# Altium schematic sheet Main.SchDoc: Actuators
size A1; SheetNumber: 1; SheetTotal: 1
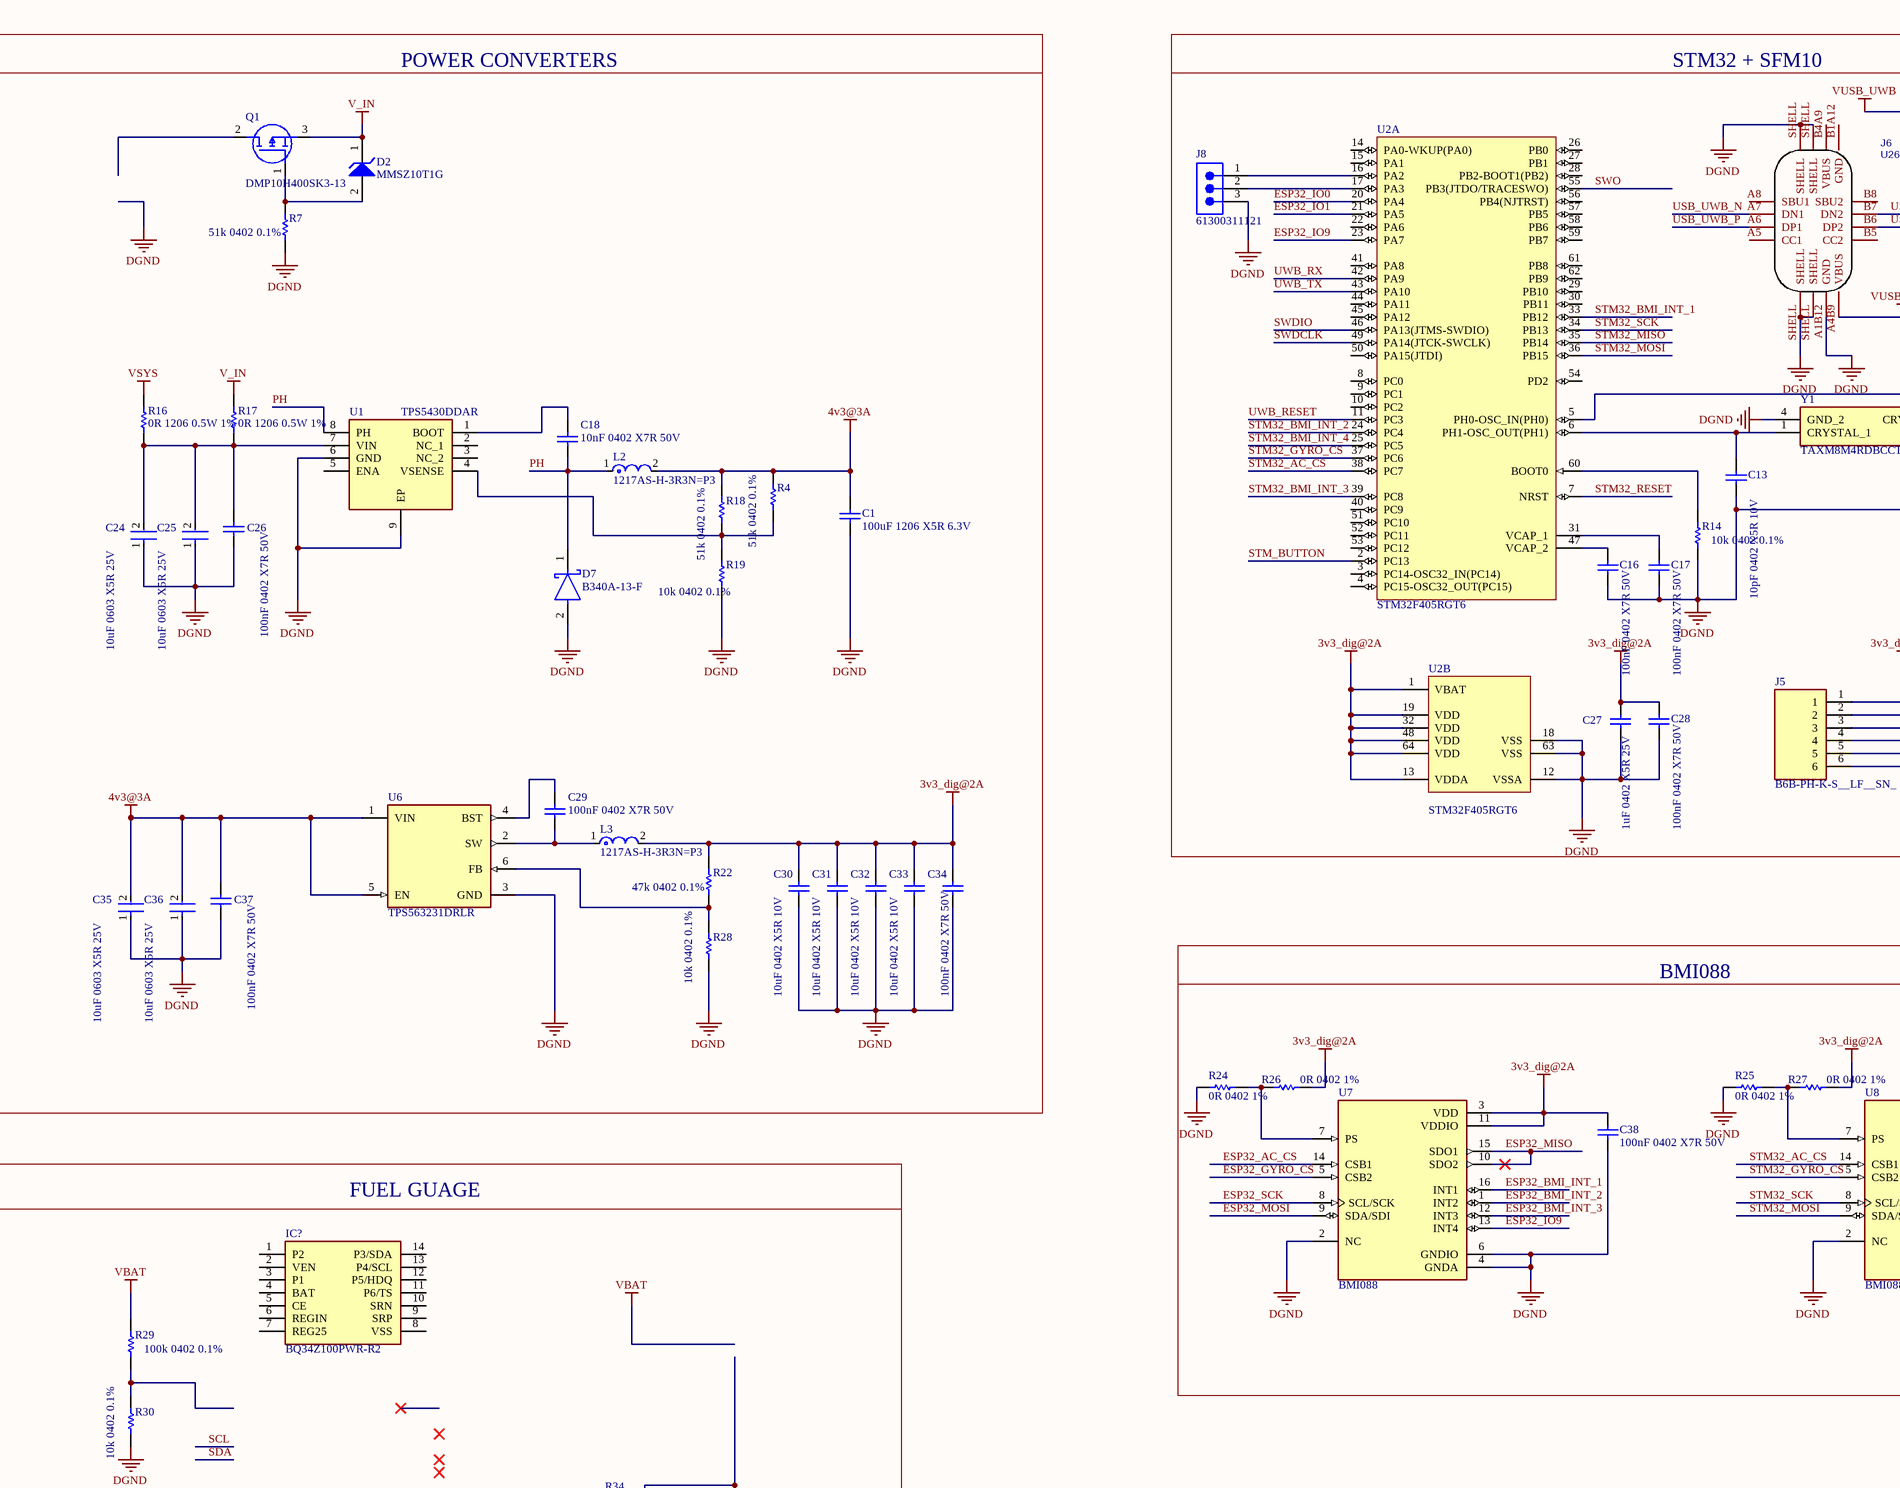
[diagram p0: Main.SchDoc, top left]
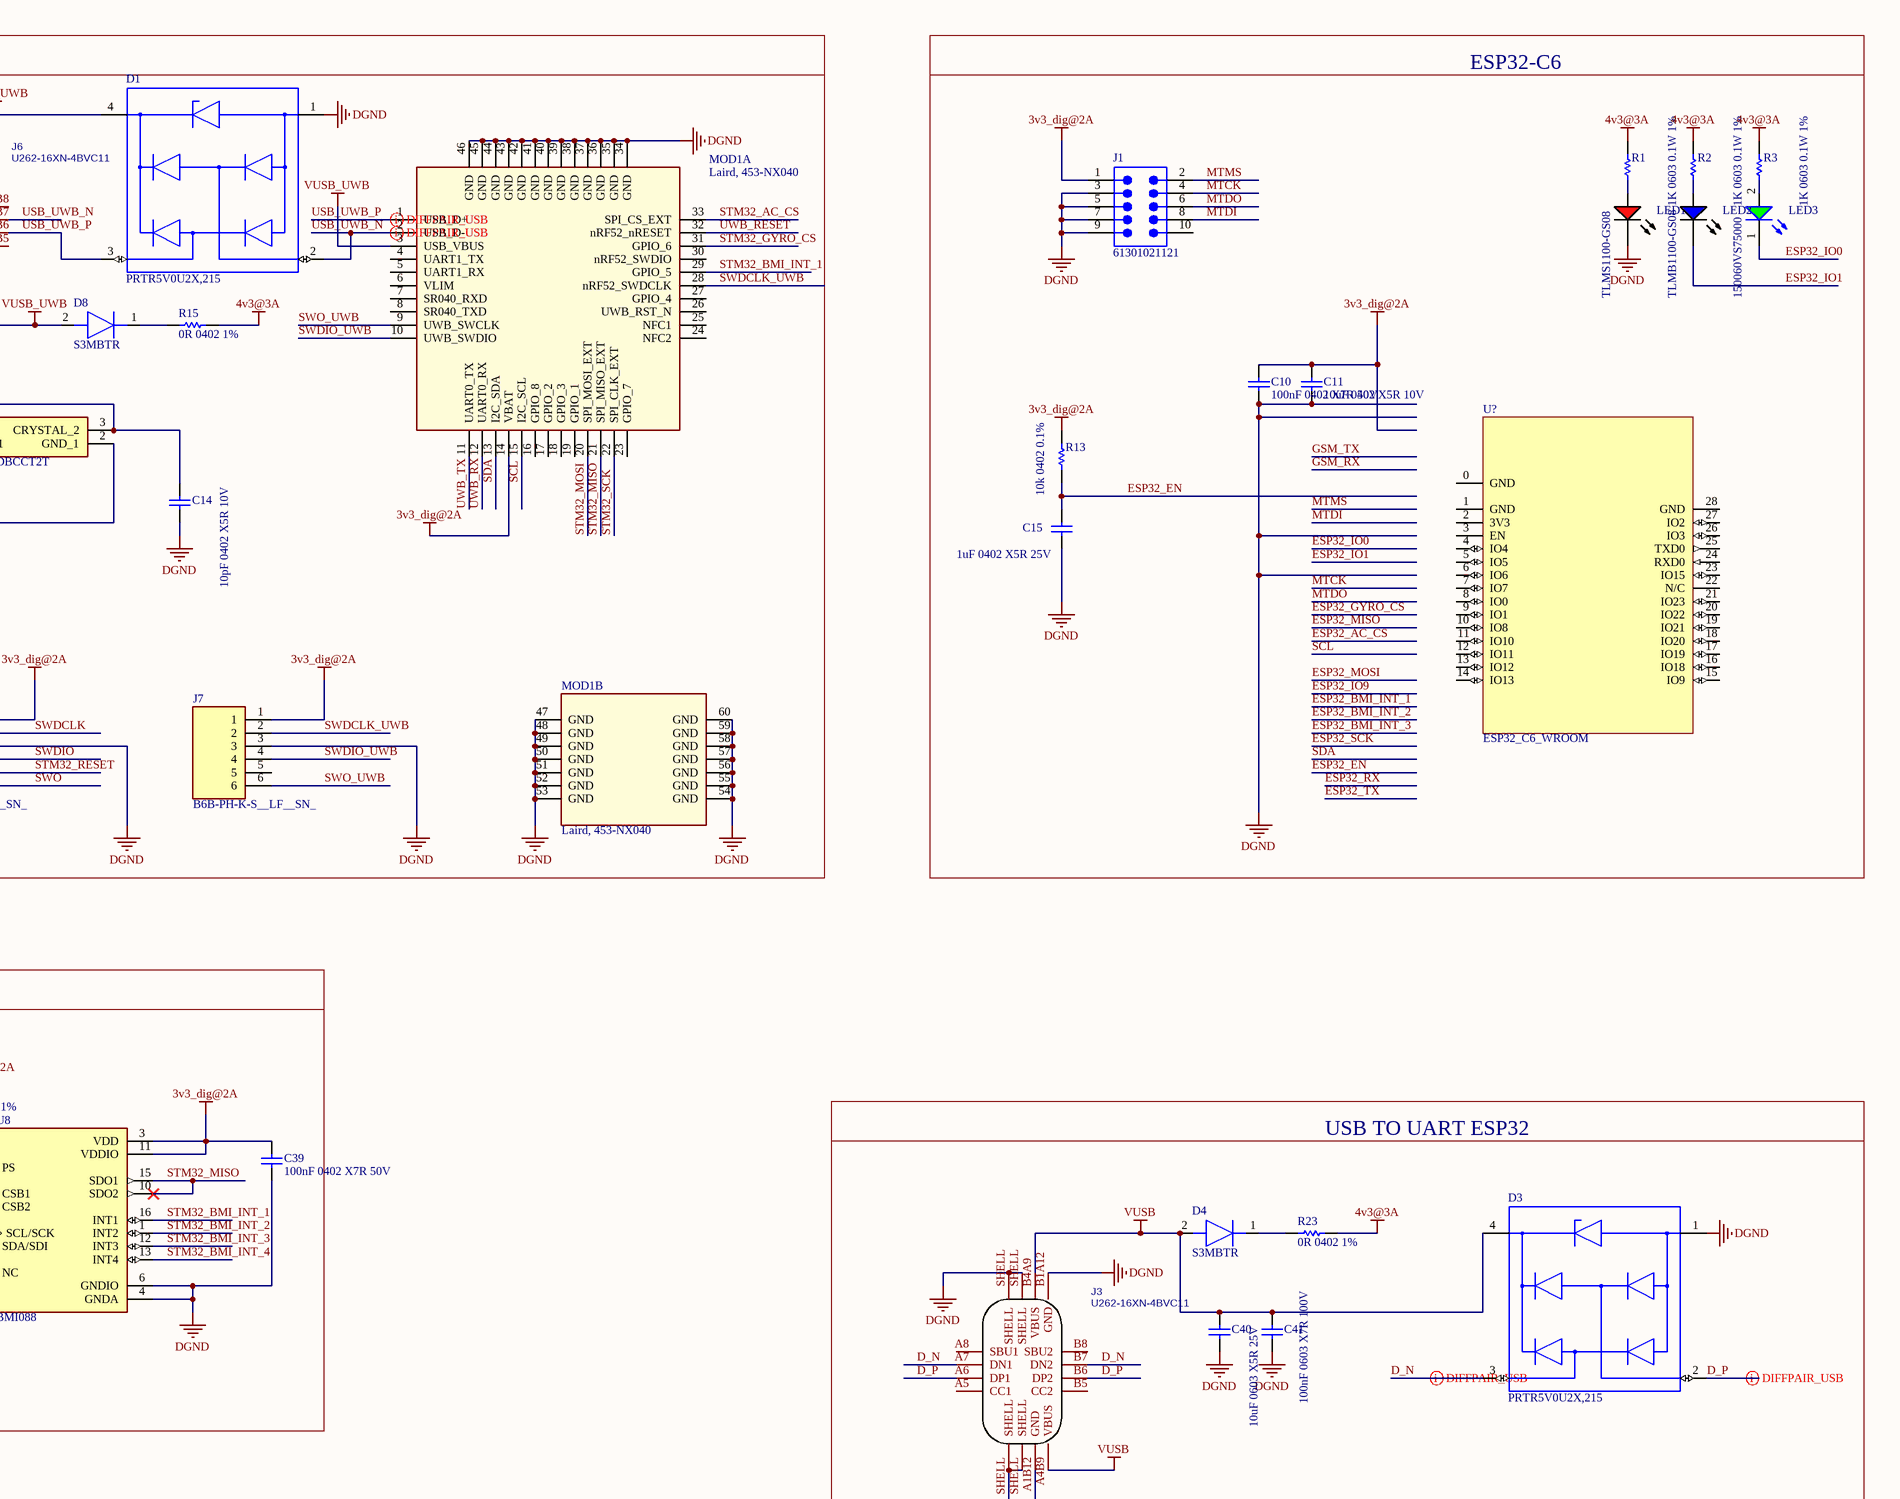
[diagram p1: Main.SchDoc, top right]
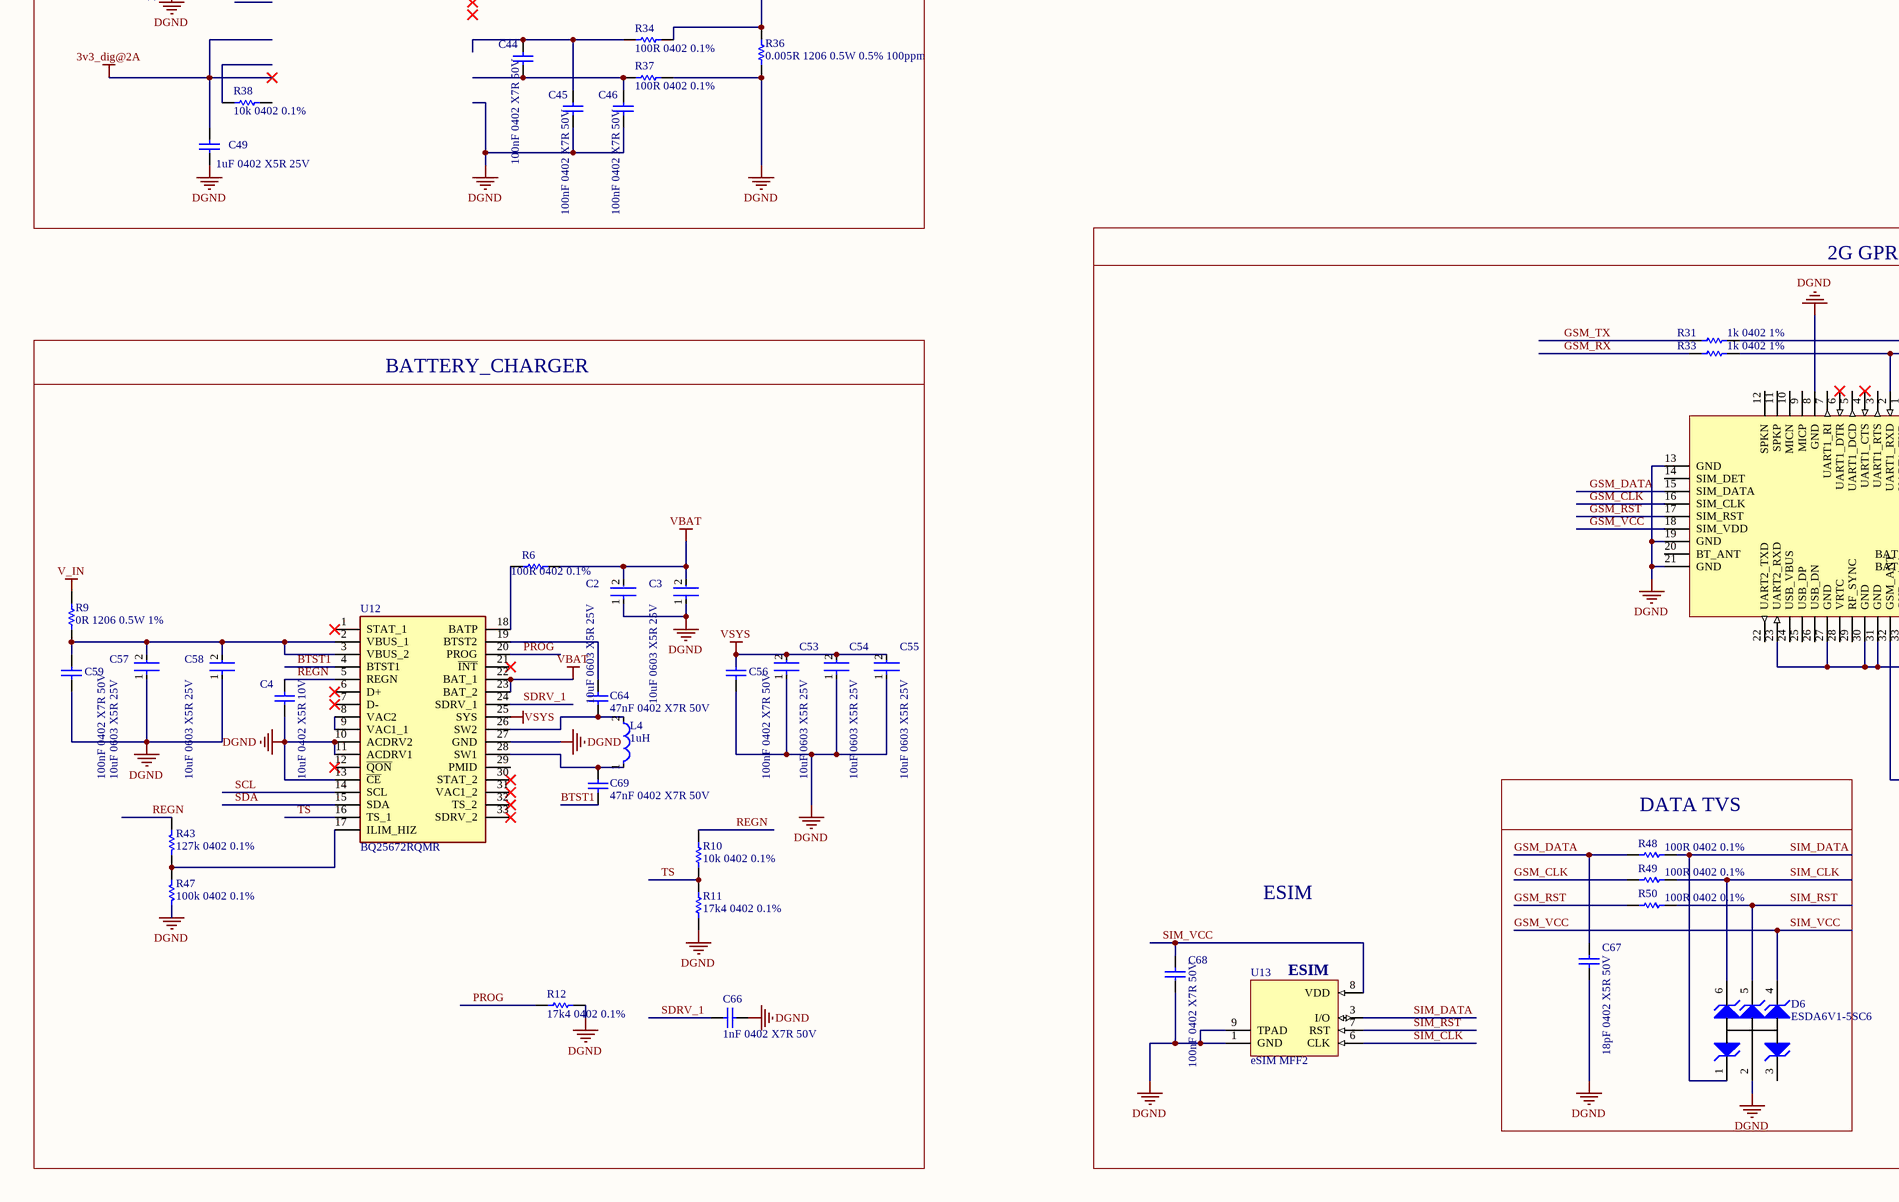
[diagram p2: Main.SchDoc, bottom left]
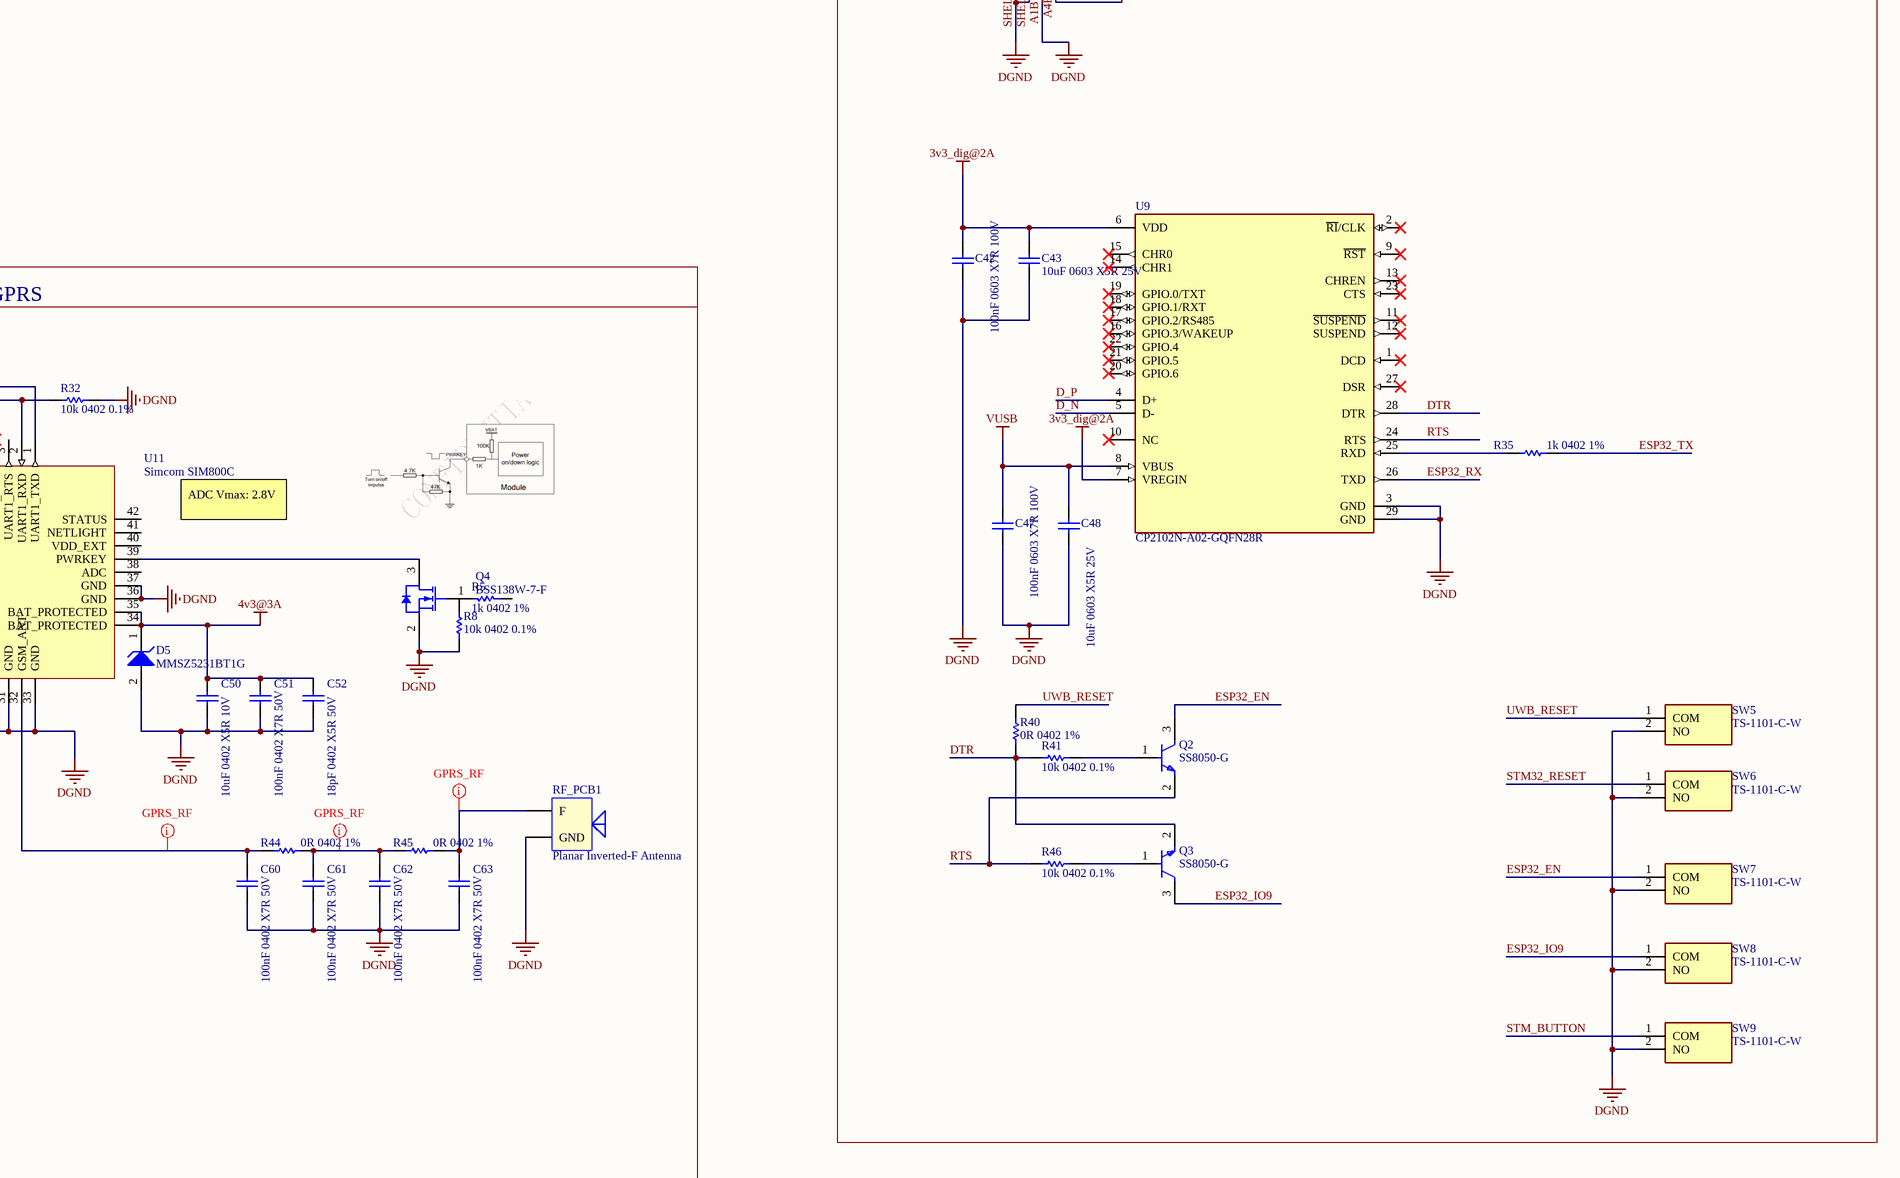
[diagram p3: Main.SchDoc, bottom right]

## Parts
C1  100uF 1206 X5R 6.3V  [CAPC3216X190X55ML30T25]
C2  10uF 0603 X5R 25V  [FP-GRM188-0_2-IPC_B]
C3  10uF 0603 X5R 25V  [FP-GRM188-0_2-IPC_B]
C4  10uF 0402 X5R 10V  [CAPC1005X55X25NL5T10]
C10  100nF 0402 X7R 50V  [CAPC1005X55X25NL5T10]
C11  10uF 0402 X5R 10V  [CAPC1005X55X25NL5T10]
C13  10pF 0402 X5R 10V  [CAPC1005X55X25NL5T10]
C14  10pF 0402 X5R 10V  [CAPC1005X55X25NL5T10]
C15  1uF 0402 X5R 25V  [CAPC1005X55X25NL5T10]
C16  100nF 0402 X7R 50V  [CAPC1005X55X25NL5T10]
C17  100nF 0402 X7R 50V  [CAPC1005X55X25NL5T10]
C18  10nF 0402 X7R 50V  [CAPC1005X55X25NL5T10]
C24  10uF 0603 X5R 25V  [FP-GRM188-0_2-IPC_B]
C25  10uF 0603 X5R 25V  [FP-GRM188-0_2-IPC_B]
C26  100nF 0402 X7R 50V  [CAPC1005X55X25NL5T10]
C27  1uF 0402 X5R 25V  [CAPC1005X55X25NL5T10]
C28  100nF 0402 X7R 50V  [CAPC1005X55X25NL5T10]
C29  100nF 0402 X7R 50V  [CAPC1005X55X25NL5T10]
C30  10uF 0402 X5R 10V  [CAPC1005X55X25NL5T10]
C31  10uF 0402 X5R 10V  [CAPC1005X55X25NL5T10]
C32  10uF 0402 X5R 10V  [CAPC1005X55X25NL5T10]
C33  10uF 0402 X5R 10V  [CAPC1005X55X25NL5T10]
C34  100nF 0402 X7R 50V  [CAPC1005X55X25NL5T10]
C35  10uF 0603 X5R 25V  [FP-GRM188-0_2-IPC_B]
C36  10uF 0603 X5R 25V  [FP-GRM188-0_2-IPC_B]
C37  100nF 0402 X7R 50V  [CAPC1005X55X25NL5T10]
C38  100nF 0402 X7R 50V  [CAPC1005X55X25NL5T10]
C39  100nF 0402 X7R 50V  [CAPC1005X55X25NL5T10]
C40  10uF 0603 X5R 25V  [CAPC1608X60X35NL10T15]
C41  100nF 0603 X7R 100V  [CAPC1608X60X35NL10T15]
C42  100nF 0603 X7R 100V  [CAPC1608X60X35NL10T15]
C43  10uF 0603 X5R 25V  [CAPC1608X60X35NL10T15]
C44  100nF 0402 X7R 50V  [CAPC1005X55X25NL5T10]
C45  100nF 0402 X7R 50V  [CAPC1005X55X25NL5T10]
C46  100nF 0402 X7R 50V  [CAPC1005X55X25NL5T10]
C47  100nF 0603 X7R 100V  [CAPC1608X60X35NL10T15]
C48  10uF 0603 X5R 25V  [CAPC1608X60X35NL10T15]
C49  1uF 0402 X5R 25V  [CAPC1005X55X25NL5T10]
C50  10uF 0402 X5R 10V  [CAPC1005X55X25NL5T10]
C51  100nF 0402 X7R 50V  [CAPC1005X55X25NL5T10]
C52  18pF 0402 X5R 50V  [CAPC1005X55X25NL5T10]
C53  10uF 0603 X5R 25V  [FP-GRM188-0_2-IPC_B]
C54  10uF 0603 X5R 25V  [FP-GRM188-0_2-IPC_B]
C55  10uF 0603 X5R 25V  [FP-GRM188-0_2-IPC_B]
C56  100nF 0402 X7R 50V  [CAPC1005X55X25NL5T10]
C57  10uF 0603 X5R 25V  [FP-GRM188-0_2-IPC_B]
C58  10uF 0603 X5R 25V  [FP-GRM188-0_2-IPC_B]
C59  100nF 0402 X7R 50V  [CAPC1005X55X25NL5T10]
C60  100nF 0402 X7R 50V  [CAPC1005X55X25NL5T10]
C61  100nF 0402 X7R 50V  [CAPC1005X55X25NL5T10]
C62  100nF 0402 X7R 50V  [CAPC1005X55X25NL5T10]
C63  100nF 0402 X7R 50V  [CAPC1005X55X25NL5T10]
C64  47nF 0402 X7R 50V  [CAPC1005X55X25NL5T10]
C66  1nF 0402 X7R 50V  [CAPC1005X55X25NL5T10]
C67  18pF 0402 X5R 50V  [CAPC1005X55X25NL5T10]
C68  100nF 0402 X7R 50V  [CAPC1005X55X25NL5T10]
C69  47nF 0402 X7R 50V  [CAPC1005X55X25NL5T10]
D1  PRTR5V0U2X,215  [FP-SOT143B-MFG]
D2  MMSZ10T1G  [ONSC-SOD-123-2-425-04_V]
D3  PRTR5V0U2X,215  [FP-SOT143B-MFG]
D4  S3MBTR  [DIOM5236X260N]
D5  MMSZ5231BT1G  [ONSC-SOD-123-2-425-04_V]
D6  ESDA6V1-5SC6  [MF06A_N]
D7  B340A-13-F  [FP-SMA-MFG]
D8  S3MBTR  [DIOM5236X260N]
IC?  BQ34Z100PWR-R2  [SOP65P640X120-14N]
J1  61301021121  [61301021121]
J3  U262-16XN-4BVC11  [USB-3.1-SMD_U262-161N-4BVC11]
J5  B6B-PH-K-S__LF__SN_  [SHDR6W50P0X200_1X6_1390X450X600P]
J6  U262-16XN-4BVC11  [USB-3.1-SMD_U262-161N-4BVC11]
J7  B6B-PH-K-S__LF__SN_  [SHDR6W50P0X200_1X6_1390X450X600P]
J8  61300311121  [61300311121]
L2  1217AS-H-3R3N=P3  [FP-DEM8045C-MFG]
L3  1217AS-H-3R3N=P3  [FP-DEM8045C-MFG]
L4  Inductance: 1uH  [FP-DFE201612C-IPC_A]  (hidden comment: DFE201612E-1R0M=P2)
LED1  TLMS1100-GS08  [VISH-TLMX1100_V]
LED2  TLMB1100-GS08  [VISH-TLMX1100-2_V]
LED3  150060VS75000  [WL-SMCW_0603_150060xx75000]
MOD1  Laird, 453-NX040  [PCBComponent_1]  (parts A,B of 2)
Q1  DMP10H400SK3-13  [DMP10H400SK313]
Q2  SS8050-G  [FP-SS8050-G-MFG]
Q3  SS8050-G  [FP-SS8050-G-MFG]
Q4  BSS138W-7-F  [DIOD-SOT323-3_V]
R1  1K 0603 0.1W 1%  [RESC1609X55X30ML10T20]
R2  1K 0603 0.1W 1%  [RESC1609X55X30ML10T20]
R3  1K 0603 0.1W 1%  [RESC1609X55X30ML10T20]
R4  51k 0402 0.1%  [RESC1005X40X25ML05T10]
R5  1k 0402 1%  [RESC1005X40X25ML05T10]
R6  100R 0402 0.1%  [RESC1005X40X25ML05T10]
R7  51k 0402 0.1%  [RESC1005X40X25ML05T10]
R8  10k 0402 0.1%  [RESC1005X40X25ML05T10]
R9  0R 1206 0.5W 1%  [CAPC3216X180X55ML20T25]
R10  10k 0402 0.1%  [RESC1005X40X25ML05T10]
R11  17k4 0402 0.1%  [RESC1005X40X25ML05T10]
R12  17k4 0402 0.1%  [RESC1005X40X25ML05T10]
R13  10k 0402 0.1%  [RESC1005X40X25ML05T10]
R14  10k 0402 0.1%  [RESC1005X40X25ML05T10]
R15  0R 0402 1%  [RESC1005X40X25ML05T10]
R16  0R 1206 0.5W 1%  [CAPC3216X180X55ML20T25]
R17  0R 1206 0.5W 1%  [CAPC3216X180X55ML20T25]
R18  51k 0402 0.1%  [RESC1005X40X25ML05T10]
R19  10k 0402 0.1%  [RESC1005X40X25ML05T10]
R22  47k 0402 0.1%  [RESC1005X40X25ML05T10]
R23  0R 0402 1%  [RESC1005X40X25ML05T10]
R24  0R 0402 1%  [RESC1005X40X25ML05T10]
R25  0R 0402 1%  [RESC1005X40X25ML05T10]
R26  0R 0402 1%  [RESC1005X40X25ML05T10]
R27  0R 0402 1%  [RESC1005X40X25ML05T10]
R28  10k 0402 0.1%  [RESC1005X40X25ML05T10]
R29  100k 0402 0.1%  [RESC1005X40X25ML05T10]
R30  10k 0402 0.1%  [RESC1005X40X25ML05T10]
R31  1k 0402 1%  [RESC1005X40X25ML05T10]
R32  10k 0402 0.1%  [RESC1005X40X25ML05T10]
R33  1k 0402 1%  [RESC1005X40X25ML05T10]
R34  100R 0402 0.1%  [RESC1005X40X25ML05T10]
R35  1k 0402 1%  [RESC1005X40X25ML05T10]
R36  0.005R 1206 0.5W 0.5% 100ppm  [CAPC3216X180X55ML20T25]
R37  100R 0402 0.1%  [RESC1005X40X25ML05T10]
R38  10k 0402 0.1%  [RESC1005X40X25ML05T10]
R40  0R 0402 1%  [RESC1005X40X25ML05T10]
R41  10k 0402 0.1%  [RESC1005X40X25ML05T10]
R43  127k 0402 0.1%  [RESC1005X40X25ML05T10]
R44  0R 0402 1%  [RESC1005X40X25ML05T10]
R45  0R 0402 1%  [RESC1005X40X25ML05T10]
R46  10k 0402 0.1%  [RESC1005X40X25ML05T10]
R47  100k 0402 0.1%  [RESC1005X40X25ML05T10]
R48  100R 0402 0.1%  [RESC1005X40X25ML05T10]
R49  100R 0402 0.1%  [RESC1005X40X25ML05T10]
R50  100R 0402 0.1%  [RESC1005X40X25ML05T10]
RF_PCB1  Planar Inverted-F Antenna  [PCB-k9titb4465gfk1ijwrnj-1]  (no BOM)
SW5  TS-1101-C-W  [TS1101CW]
SW6  TS-1101-C-W  [TS1101CW]
SW7  TS-1101-C-W  [TS1101CW]
SW8  TS-1101-C-W  [TS1101CW]
SW9  TS-1101-C-W  [TS1101CW]
U1  TPS5430DDAR  [SOIC127P600X170-9N]
U2  STM32F405RGT6  [STM-LQFP64_M]  (parts A,B of 2)
U6  TPS563231DRLR  [FP-DRL0006A-MFG]
U7  BMI088  [PQFN50P450X300X100-16N]
U8  BMI088  [PQFN50P450X300X100-16N]
U9  CP2102N-A02-GQFN28R  [FP-CP2102N-A02-GQFN28R-MFG]
U11  Simcom SIM800C  [SIM800C]
U12  BQ25672RQMR  [BQ25672RQMR]
U13  eSIM MFF2  [SON127P600X95_HS-9N]
U?  ESP32_C6_WROOM  [ESP32_C6_WROOM]
Y1  TAXM8M4RDBCCT2T  [TAXM8M4RDBCCT2T]

## Blocks framed on the sheet
POWER CONVERTERS: C1 C18 C24-C26 C29-C37 D2 D7 L2 L3 Q1 R4 R7 R16-R19 R22 R28 U1 U6
STM32 + SFM10: C13 C14 C16 C17 C27 C28 D1 D8 J5-J8 MOD1 R14 R15 U2 Y1
ESP32-C6: C10 C11 C15 J1 LED1-LED3 R1-R3 R13 U?
BMI088: C38 C39 R24-R27 U7 U8
USB TO UART ESP32: C40-C43 C47 C48 D3 D4 J3 Q2 Q3 R23 R35 R40 R41 R46 SW5-SW9 U9
FUEL GUAGE: C44-C46 C49 IC? R29 R30 R34 R36-R38
BATTERY_CHARGER: C2-C4 C53-C59 C64 C66 C69 L4 R6 R9-R12 R43 R47 U12
DATA TVS: C67 D6 R48-R50

## Nets
3v3_dig@2A: C10.2 C11.1 C27.2 C28.1 C30.2 C31.2 C32.2 C33.2 C34.2 C38.1 C39.1 C42.2 C43.2 C49.2 J1.1 J5.1 J7.1 L3.2 MOD1.14(VBAT) R13.2 R22.2 R26.1 R27.1 U2.1(VBAT) U2.13(VDDA) U2.19(VDD) U2.32(VDD) U2.48(VDD) U2.64(VDD) U7.3(VDD) U7.11(VDDIO) U8.3(VDD) U8.11(VDDIO) U9.6(VDD) U9.7(VREGIN)
4v3@3A: C1.2 C35.2 C36.2 C37.2 C50.2 C51.2 C52.2 D5.1(K) L2.2 R1.2 R2.2 R3.2 R4.2 R15.2 R18.2 R23.2 U6.1(VIN) U6.5(EN) U11.34(BAT_PROTECTED) U11.35(BAT_PROTECTED)
DGND: C1.1 C2.1 C3.1 C4.1 C10.1 C11.2 C13.2 C14.2 C15.1 C16.2 C17.2 C24.1 C25.1 C26.1 C27.1 C28.2 C30.1 C31.1 C32.1 C33.1 C34.1 C35.1 C36.1 C37.1 C38.2 C39.2 C40.1 C41.1 C42.1 C43.1 C45.1 C46.1 C47.1 C48.1 C49.1 C50.1 C51.1 C52.1 C53.1 C54.1 C55.1 C56.1 C57.1 C58.1 C59.1 C60.1 C61.1 C62.1 C63.1 C66.1 C67.1 C68.1 D1.1(GND) D3.1(GND) D5.2(A) D6.2(K) D7.2(A) J1.3 J1.5 J1.7 J1.9 J3.A1B12(GND) J3.B1A12(GND) J3.SHELL J5.3 J6.A1B12(GND) J6.SHELL J7.3 J8.3 LED1.2(K) MOD1.34(GND) MOD1.35(GND) MOD1.36(GND) MOD1.37(GND) MOD1.38(GND) MOD1.39(GND) MOD1.40(GND) MOD1.41(GND) MOD1.42(GND) MOD1.43(GND) MOD1.44(GND) MOD1.45(GND) MOD1.46(GND) MOD1.47(GND) MOD1.48(GND) MOD1.49(GND) MOD1.50(GND) MOD1.51(GND) MOD1.52(GND) MOD1.53(GND) MOD1.54(GND) MOD1.55(GND) MOD1.56(GND) MOD1.57(GND) MOD1.58(GND) MOD1.59(GND) MOD1.60(GND) Q4.2(S) R7.1 R8.2 R11.2 R12.1 R14.1 R19.1 R24.1 R25.1 R28.1 R30.1 R32.1 R36.2 R37.1 R47.1 RF_PCB1.2(GND) SW5.2(NO) SW6.2(NO) SW7.2(NO) SW8.2(NO) SW9.2(NO) U1.6(GND) U1.9(EP) U2.12(VSSA) U2.18(VSS) U2.63(VSS) U6.3(GND) U7.2(NC) U7.4(GNDA) U7.6(GNDIO) U8.2(NC) U8.4(GNDA) U8.6(GNDIO) U9.3(GND) U9.29(GND) U11.8(GND) U11.13(GND) U11.19(GND) U11.21(GND) U11.23(UART2_RXD) U11.27(GND) U11.30(GND) U11.31(GND) U11.33(GND) U11.36(GND) U11.37(GND) U12.10(ACDRV2) U12.11(ACDRV1) U12.13(~{CE}) U12.27(GND) U13.1(GND) U13.9(TPAD) Y1.2(GND_1) Y1.4(GND_2)
V_IN: D2.1(K) Q1.3(S) R9.1 R17.1
VBAT: C2.2 C3.2 R6.1 R29.2 U12.22(BAT_1) U12.23(BAT_2)
VSYS: C53.2 C54.2 C55.2 C56.2 R16.2 U12.25(SYS)
VUSB: C40.2 C41.2 C47.2 C48.2 D3.4(VCC) D4.2(A) J3.A4B9(VBUS) J3.B4A9(VBUS) U9.8(VBUS)
VUSB_UWB: D1.4(VCC) D8.2(A) J6.A4B9(VBUS) MOD1.3(USB_VBUS)
BTST1: C69.1 U12.4(BTST1)
D_N: D3.3(I/O_2) J3.A7(DN1) J3.B7(DN2) U9.5(D-)
D_P: D3.2(I/O_1) J3.A6(DP1) J3.B6(DP2) U9.4(D+)
DTR: Q3.2(E) R40.1 R41.2 U9.28(DTR)
ESP32_AC_CS: U7.14(CSB1)
ESP32_BMI_INT_1: U7.16(INT1)
ESP32_BMI_INT_2: U7.1(INT2)
ESP32_BMI_INT_3: U7.12(INT3)
ESP32_EN: C15.2 Q2.3(C) R13.1 SW7.1(COM)
ESP32_GYRO_CS: U7.5(CSB2)
ESP32_IO0: LED3.1(K) U2.20(PA4)
ESP32_IO1: LED2.2(K) U2.21(PA5)
ESP32_IO9: Q3.3(C) SW8.1(COM) U2.23(PA7) U7.13(INT4)
ESP32_MISO: U7.10(SDO2) U7.15(SDO1)
ESP32_MOSI: U7.9(SDA/SDI)
ESP32_RX: U9.26(TXD)
ESP32_SCK: U7.8(SCL/SCK)
ESP32_TX: R35.1
GSM_CLK: R49.2 U11.16(SIM_CLK)
GSM_DATA: C67.2 R48.2 U11.15(SIM_DATA)
GSM_RST: R50.2 U11.17(SIM_RST)
GSM_RX: R33.2
GSM_TX: R31.2
GSM_VCC: C68.2 D6.4(A) U11.18(SIM_VDD) U13.8(VDD)  [also labelled SIM_VCC]
MTCK: J1.4
MTDI: J1.8
MTDO: J1.6
MTMS: J1.2
PH: C18.1 D7.1(C) L2.1 U1.8(PH)
PROG: R12.2 U12.20(PROG)
REGN: C4.2 R10.1 R43.2 U12.5(REGN)
RTS: Q2.2(E) R46.2 U9.24(RTS)
SCL: MOD1.15(I2C_SCL) U12.14(SCL)
SDA: MOD1.13(I2C_SDA) U12.15(SDA)
SDRV_1: C66.2 U12.24(SDRV_1)
SIM_CLK: D6.6(A) R49.1 U13.6(CLK)
SIM_DATA: D6.1(K) R48.1 U13.3(I/O)
SIM_RST: D6.5(A) R50.1 U13.7(RST)
STM32_AC_CS: MOD1.33(SPI_CS_EXT) U2.38(PC7) U8.14(CSB1)
STM32_BMI_INT_1: MOD1.29(GPIO_5) U2.33(PB12) U8.16(INT1)
STM32_BMI_INT_2: U2.24(PC4) U8.1(INT2)
STM32_BMI_INT_3: U2.39(PC8) U8.12(INT3)
STM32_BMI_INT_4: U2.25(PC5) U8.13(INT4)
STM32_GYRO_CS: MOD1.31(GPIO_6) U2.37(PC6) U8.5(CSB2)
STM32_MISO: MOD1.21(SPI_MISO_EXT) U2.35(PB14) U8.10(SDO2) U8.15(SDO1)
STM32_MOSI: MOD1.20(SPI_MOSI_EXT) U2.36(PB15) U8.9(SDA/SDI)
STM32_RESET: J5.5 SW6.1(COM) U2.7(NRST)
STM32_SCK: MOD1.22(SPI_CLK_EXT) U2.34(PB13) U8.8(SCL/SCK)
STM_BUTTON: SW9.1(COM) U2.2(PC13)
SWDCLK: J5.2 U2.49(PA14(JTCK-SWCLK))
SWDCLK_UWB: J7.2 MOD1.28(nRF52_SWDCLK)
SWDIO: J5.4 U2.46(PA13(JTMS-SWDIO))
SWDIO_UWB: J7.4 MOD1.10(UWB_SWDIO)
SWO: J5.6 U2.55(PB3(JTDO/TRACESWO))
SWO_UWB: J7.6 MOD1.9(UWB_SWCLK)
TS: R10.2 R11.1 U12.16(TS_1)
USB_UWB_N: D1.2(I/O_1) J6.A7(DN1) J6.B7(DN2) MOD1.2(USB_D-)
USB_UWB_P: D1.3(I/O_2) J6.A6(DP1) J6.B6(DP2) MOD1.1(USB_D+)
UWB_RESET: MOD1.32(nRF52_nRESET) R40.2 SW5.1(COM) U2.11(PC3)
UWB_RX: MOD1.12(UART0_RX) U2.42(PA9)
UWB_TX: MOD1.11(UART0_TX) U2.43(PA10)
NetC13_1: C13.1 U2.6(PH1-OSC_OUT(PH1)) Y1.1(CRYSTAL_1)
NetC14_1: C14.1 U2.5(PH0-OSC_IN(PH0)) Y1.3(CRYSTAL_2)
NetC16_1: C16.1 U2.47(VCAP_2)
NetC17_1: C17.1 U2.31(VCAP_1)
NetC18_2: C18.2 U1.1(BOOT)
NetC24_2: C24.2 C25.2 C26.2 R16.1 R17.2 U1.7(VIN)
NetC29_1: C29.1 L3.1 U6.2(SW)
NetC29_2: C29.2 U6.4(BST)
NetC44_1: C44.1 C46.2 R37.2
NetC44_2: C44.2 C45.2 R34.2
NetC57_2: C57.2 C58.2 C59.2 R9.2 U12.2(VBUS_1) U12.3(VBUS_2)
NetC60_2: C60.2 R44.2 U11.32(GSM_ANT)
NetC61_2: C61.2 C62.2 R44.1 R45.2
NetC63_2: C63.2 R45.1 RF_PCB1.1(F)
NetC64_1: C64.1 L4.2 U12.26(SW2)
NetC64_2: C64.2 U12.19(BTST2)
NetC69_2: C69.2 L4.1 U12.28(SW1)
NetD2_2: D2.2(A) Q1.1(G) R7.2
NetD4_1: D4.1(K) R23.1
NetD8_1: D8.1(K) R15.1
NetJ8_1: J8.1 U2.16(PA2)
NetJ8_2: J8.2 U2.17(PA3)
NetLED1_1: LED1.1(A) R1.1
NetLED2_1: LED2.1(A) R2.1
NetLED3_2: LED3.2(A) R3.1
NetQ2_1: Q2.1(B) R41.1
NetQ3_1: Q3.1(B) R46.1
NetQ4_3: Q4.3(D) U11.39(PWRKEY)
NetR4_1: R4.1 R18.1 R19.2 U1.4(VSENSE)
NetR5_1: R5.1 R8.1
NetR6_2: R6.2 U12.18(BATP)
NetR14_2: R14.2 U2.60(BOOT0)
NetR22_1: R22.1 R28.2 U6.6(FB)
NetR24_2: R24.2 R26.2 U7.7(PS)
NetR25_2: R25.2 R27.2 U8.7(PS)
NetR29_1: R29.1 R30.2
NetR31_1: R31.1 U11.1(UART1_TXD)
NetR32_2: R32.2 R33.1 U11.2(UART1_RXD)
NetR34_1: R34.1 R36.1
NetR35_2: R35.2 U9.25(RXD)
NetR43_1: R43.1 R47.2 U12.17(ILIM_HIZ)
NetU12_8: U12.8(VAC2) U12.9(VAC1_1)

Not connected (* = marked no-connect by the designer): D6 3(K); IC? 1(P2) 2(VEN) 3(P1) 4(BAT) 5(CE) 6(REGIN) 7(REG25) 8(VSS) 9(SRP) 10(SRN) 11(P6/TS) 12(P5/HDQ) 13(P4/SCL) 14(P3/SDA); J1 10; J3 A5(CC1) A8(SBU1) B5(CC2) B8(SBU2); J6 A5(CC1) A8(SBU1) B1A12(GND) B4A9(VBUS) B5(CC2) B8(SBU2); J7 5; MOD1 4(UART1_TX) 5(UART1_RX) 6(VLIM) 7(SR040_RXD) 8(SR040_TXD) 16(GPIO_8) 17(GPIO_2) 18(GPIO_3) 19(GPIO_1) 23(GPIO_7) 24(NFC2) 25(NFC1) 26(UWB_RST_N) 27(GPIO_4) 30(nRF52_SWDIO); Q1 2(D); Q4 1(G); R5 2; R38 1 2; U1 2(NC_1) 3(NC_2) 5(ENA); U2 3(PC14-OSC32_IN(PC14)) 4(PC15-OSC32_OUT(PC15)) 8(PC0) 9(PC1) 10(PC2) 14(PA0-WKUP(PA0)) 15(PA1) 22(PA6) 26(PB0) 27(PB1) 28(PB2-BOOT1(PB2)) 29(PB10) 30(PB11) 40(PC9) 41(PA8) 44(PA11) 45(PA12) 50(PA15(JTDI)) 51(PC10) 52(PC11) 53(PC12) 54(PD2) 56(PB4(NJTRST)) 57(PB5) 58(PB6) 59(PB7) 61(PB8) 62(PB9); U9 1(DCD)* 2(~{RI}/CLK)* 9(~{RST})* 10(NC)* 11(~{SUSPEND})* 12(SUSPEND)* 13(CHREN)* 14(CHR1)* 15(CHR0)* 16(GPIO.3/WAKEUP)* 17(GPIO.2/RS485)* 18(GPIO.1/RXT)* 19(GPIO.0/TXT)* 20(GPIO.6)* 21(GPIO.5)* 22(GPIO.4)* 23(CTS)* 27(DSR)*; U11 3(UART1_RTS) 4(UART1_CTS)* 5(UART1_DCD) 6(UART1_DTR)* 7(UART1_RI) 9(MICP) 10(MICN) 11(SPKP) 12(SPKN) 14(SIM_DET) 20(BT_ANT) 22(UART2_TXD) 24(USB_VBUS) 25(USB_DP) 26(USB_DN) 28(VRTC) 29(RF_SYNC) 38(ADC) 40(VDD_EXT) 41(NETLIGHT) 42(STATUS); U12 1(STAT_1)* 6(D+)* 7(D-)* 12(~{QON})* 21(~{INT})* 29(PMID) 30(STAT_2)* 31(VAC1_2)* 32(TS_2)* 33(SDRV_2)*; U? 0(GND) 1(GND) 2(3V3) 3(EN) 4(IO4) 5(IO5) 6(IO6) 7(IO7) 8(IO0) 9(IO1) 10(IO8) 11(IO10) 12(IO11) 13(IO12) 14(IO13) 15(IO9) 16(IO18) 17(IO19) 18(IO20) 19(IO21) 20(IO22) 21(IO23) 22(N/C) 23(IO15) 24(RXD0) 25(TXD0) 26(IO3) 27(IO2) 28(GND)

## Layout directives
net class GPRS_RF: NetC60_2, NetC61_2, NetC63_2
differential pair; differential pair class USB: D_N, D_P, USB_UWB_N, USB_UWB_P

## Notes on the sheet
- 2G GPRS
- ADC Vmax: 2.8V
- ESIM
- (near U13) ESIM
- Title
- Size:
- Date:
- A3
- Author:
- Time:
- Revision:
- Sheet
- of
- File:

## Library data of the parts
C1 = CMP-1662-00011-2: Chip Capacitor, 100 uF, +/- 20%, 6.3 V, -55 to 85 degC, 1206 (3216 Metric), RoHS, Tape and Reel; PartNumber: GRM31CR60J107ME39L; Case\/Package: 1206; REACH SVHC: No SVHC; Height: 1.6 mm; Tolerance: 20%; Packaging: Tape and Reel; Mount: Surface Mount; PackageDescription: 2-Pin Surface Mount Device, Body 3.2 x 1.6 mm; ComponentLink1URL: http://www.murata.com/; Pins: 2; ComponentLink2Description: Datasheet; PackageReference: 1206; Width: 1.6 mm; Package Quantity: 2000; Capacitance: 100 uF; Min Operating Temperature: -55 degC; Voltage Rating (DC): 6.3 V; Type (Capacitors): X5R; Case Code (Imperial): 1206; Max Operating Temperature: 85 degC; DatasheetVersion: 09/2016; Mounting Technology: Surface Mount; Voltage Rating: 6.3 V; ComponentLink1Description: Manufacturer URL; Radiation Hardening: No; Case Code (Metric): 3216; Length: 3.2 mm; ComponentLink2URL: http://psearch.en.murata.com/capacitor/product/GRM31CR60J107ME39%23.pdf; RoHSCompliant: true; LCSC_PN: C77085
C2 C3 C24 C25 C35 C36 C53-C55 C57 C58 = CMP-06035-022879-1: LCSC_PN: C91606
C4 C10 C11 C13-C18 C26-C34 C37-C39 C44-C46 C49-C52 C56 C59-C64 C66-C69 = CMP-1662-00020-1: ComponentLink2Description: Datasheet; ComponentLink2URL: http://psearch.en.murata.com/capacitor/product/GRM155R60J105KE19%23.pdf; ComponentLink1Description: Manufacturer URL; ComponentLink1URL: http://www.murata.com/
  C4 C11 C30-C33 C50: LCSC_PN: C77000
  C10 C16 C17 C26 C28 C29 C34 C37-C39 C44-C46 C51 C56 C59-C63 C68: LCSC_PN: C77020
  C13 C14: LCSC_PN: C513681
  C15 C27 C49: LCSC_PN: C77009
  C18: LCSC_PN: C60133
  C52 C67: LCSC_PN: C33149
  C64 C69: LCSC_PN: C272875
  C66: LCSC_PN: C106205
C40 C43 C48 = CMP-121364-8: 10uF 0603 X5R 6.3V; Rated voltage: 6v3; Dielectric carachteristic: X5R; Capacitance: 10uF; package: 0603; LCSC_PN: C91606
C41 C42 C47 = CMP-c41a0d2b65641bdd-3: Manufacturar Part Number: CC0603KRX7R0BB104; package: 0603; capacitance: 100 nF; Dielectric Characteristic: X7R; Rated voltage: 100V; LCSC_PN: C113803
D1 D3 = CMP-14436-000007-1: TVS DIODE 5.5V SOT143B; LCSC_PN: C12333
D2 = CMP-1060-00410-1: Zener Voltage Regulator, 500 mW, 2-Pin SOD-123, Pb-Free, Tape and Reel; Manufacturer: On Semiconductor; P Max (W): 0.5; ComponentLink1URL: http://www.onsemi.com/; RoHS: Pb-Free; ComponentLink3Description: Package Specification; Packing: Tape and Reel; PackageVersion: Rev. G, 10/2009; ComponentLink3URL: http://www.onsemi.com/pub_link/Collateral/425-04.PDF; PartNumber: MMSZ10T1G; ComponentLink2Description: Datasheet; Mounting Technology: Surface Mount; PackageReference: SOD-123-2-425-04; DatasheetVersion: Rev. 11; ComponentLink1Description: Manufacturer URL; ComponentLink2URL: http://www.onsemi.com/pub_link/Collateral/MMSZ2V4T1-D.PDF; PackageDescription: 2-Pin SOD, Body 1.6 x 2.69 mm; LCSC_PN: C236094
D4 D8 = S3MBTR: Diode; Manufacturer_Name: SMC Diode Solutions; Datasheet Link: http://www.smc-diodes.com/propdf/S3AB-S3MB%20N0563%20REV.B.pdf; Height: 2.6mm; Manufacturer_Part_Number: S3MBTR; LCSC_PN: C47524
D5 = CMP-1060-00573-1: Zener Voltage Regulator, 500 mW, 2-Pin SOD-123, Pb-Free, Tape and Reel; Manufacturer: On Semiconductor; P Max (W): 0.5; VZ Typ (V): 5.1; PackageVersion: Rev. G, 10/2009; Mounting Technology: Surface Mount; ComponentLink2Description: Datasheet; ComponentLink3URL: http://www.onsemi.com/pub_link/Collateral/425-04.PDF; PackageDescription: 2-Pin SOD, Body 1.6 x 2.69 mm; Packing: Tape and Reel; ComponentLink2URL: http://www.onsemi.com/pub_link/Collateral/MMSZ5221BT1-D.PDF; ComponentLink1URL: http://www.onsemi.com/; PartNumber: MMSZ5231BT1G; PackageReference: SOD-123-2-425-04; RoHS: Pb-Free; ComponentLink1Description: Manufacturer URL; ComponentLink3Description: Package Specification; DatasheetVersion: Rev. 12; LCSC_PN: C2759896
D6 = CMP-924f5b40f9684d88-1: ESDA Series 5 Channel 6.1 V 50 pF SMT Uni Directional Transil Array - SOT-23-6L; Operating Voltage: 6.10 V; Power Rating: 100 W; Breakdown Voltage: 7.20 V; Lead-Free Status: Lead Free; REACH SVHC Compliance: No SVHC; Number of Pins: 6; Case/Package: SOT-23; Size-Width: 1.75 mm; Mounting Style: Surface Mount; Manufacturer Part Number: ESDA6V1-5SC6; Size-Height: 1.45 mm; OctopartID: 924f5b40f9684d88; Size-Length: 3.05 mm; Packaging: Tape & Reel (TR), Cut Tape (CT); Octopart URL: http://octopart.com/esda6v1-5sc6-stmicroelectronics-347713; RoHS: Compliant; Voltage Rating (DC): 6.10 V; Lifecycle Status: Active; TME: ESDA6V1-5SC6; LCSC_PN: C6650
D7 = CMP-1667-00003-3: DIODE SCHOTTKY 40V 3A SMA; Max Forward Surge Current (Ifsm): 80A; Forward Voltage: 500mV; Polarity: Standard; Max Reverse Current: 500uA; Capacitance: 250pF; Element Configuration: Single; Mount: Surface Mount; Output Current: 3A; Radiation Hardening: No; Width: 2.92mm; Current Rating: 3A; Termination: SMD/SMT; Voltage: 40V; Series: -; Max Operating Temperature: 125°C; Current: 3A; Max Repetitive Reverse Voltage (Vrrm): 40V; Min Operating Temperature: -55°C; REACH SVHC: No SVHC; Number of Pins: 2; Average Rectified Current: 3A; Contact Plating: Tin; RoHS Compliant: Yes; Max Reverse Voltage (DC): 40V; Packaging: Tape and Reel; Height: 2.3mm; Length: 4.6mm; Case/Package: SMA; Weight: 0.002258oz; Peak Non-Repetitive Surge Current: 80A; Package Quantity: 5000; Lead Free: Lead Free; Forward Current: 3A; Voltage Rating (DC): 40V
IC? = BQ34Z100PWR-R2: Integrated Circuit; Manufacturer_Name: Texas Instruments; Datasheet Link: https://www.arrow.com/en/products/bq34z100pwr-r2/texas-instruments?region=nac; Height: 1.2mm; Manufacturer_Part_Number: BQ34Z100PWR-R2; Mouser Part Number: 595-BQ34Z100PWR-R2; Mouser Price/Stock: https://www.mouser.co.uk/ProductDetail/Texas-Instruments/BQ34Z100PWR-R2?qs=rQFj71Wb1eWspkgmxcmVcA%3D%3D; Arrow Part Number: BQ34Z100PWR-R2; Arrow Price/Stock: https://www.arrow.com/en/products/bq34z100pwr-r2/texas-instruments?utm_currency=USD&region=europe
J1 = CMP-1502-01084-2: NexarPartId: 18818163; Current Rating: 3A; Voltage Rating: 250V; Row Spacing: 2.54mm; Insulation: Insulated; Insulation Resistance: 1GΩ; Contact Resistance: 20mΩ; Gender: Male; Connector Type: Male Pin; Number of Positions: 10; Number of Pins: 10; Termination: Through Hole; Contact Material: Copper; Lead Pitch: 2.54mm; RoHS: Compliant; Max Operating Temperature: 105°C; Flammability Rating: UL94 V-0; Contact Mating Length: 5.9944mm; Packaging: Bulk; Min Operating Temperature: -40°C; Height: 2.54mm; Contact Gender: Male; Length: 12.7mm; Housing Material: PBT; Operating Supply Voltage: 250V; Color: Black; Number of Rows: 2; Contact Plating: Gold; REACH SVHC: Unknown; Width: 12.7mm; Pitch: 2.54mm; Mount: Through Hole; Orientation: Vertical; Number of Contacts: 10; LCSC_PN: C7501289
J3 J6 = U262-16XN-4BVC11: BOM_Manufacturer: XKB Enterprise; Contributor: LCSC; BOM_Supplier: LCSC; BOM_Supplier Part: C319148; BOM_Manufacturer Part: U262-16XN-4BVC11; BOM_JLCPCB Part Class: Extended Part; spicePre: U; spiceSymbolName: U262-16XN-4BVC11; LCSC_PN: C319148
J5 J7 = B6B-PH-K-S__LF__SN_: Connector; Manufacturer_Name: JST (JAPAN SOLDERLESS TERMINALS); Manufacturer_Part_Number: B6B-PH-K-S (LF)(SN); Datasheet Link: https://www.jst-mfg.com/product/pdf/eng/ePH.pdf; Height: 6mm; Arrow Part Number: B6B-PH-K-S (LF)(SN); Arrow Price/Stock: https://www.arrow.com/en/products/b6b-ph-k-s-lf-sn/jst-manufacturing; LCSC_PN: C131342
J8 = CMP-1502-01062-3: NexarPartId: 32855521; Current Rating: 3A; Voltage Rating: 250V; Number of Positions: 3; Pitch: 2.54mm; Contact Resistance: 20mΩ; Connector Type: Male Pin; Gender: Male; REACH SVHC: Unknown; Packaging: Bulk; Contact Material: Copper; Min Operating Temperature: -40°C; Number of Rows: 1; Orientation: Vertical; RoHS: Compliant; Contact Plating: Gold; Max Operating Temperature: 105°C; Mount: Through Hole; Height: 8.94mm; Operating Supply Voltage: 250V; Number of Pins: 3; Contact Mating Length: 5.9944mm; Number of Contacts: 3; Color: Black; Lead Free: Lead Free; Lead Pitch: 2.54mm; Termination: Solder
L2 = CMP-06042-006799-1: 3.45A 4.7uH ±20% SMD,8x8mm Power Inductors ROHS; Saturation Current: 7.7A; Core Material: Ferrite; Tolerance: 30%; Current Rating: 6.8A; Inductance: 3.3uH; Test Frequency: 100kHz; DC Resistance (DCR): 14.4mR; Shielding: Shielded; Height - Seated (Max): 0.177inch; Packaging: Tape and Reel; Resistor Type: Wirewound; Length: 0.315inch; Number of Pins: 2; Case/Package: SMD/SMT; Mount: Surface Mount; Max DC Current: 6.8A; Width: 0.315inch; LCSC_PN: C514864
L3 = CMP-06042-006799-1: Shielded Wirewound Inductor 3.3uH 30% 6800mA 0.0144Ω SMD; Saturation Current: 7.7A; Core Material: Ferrite; Current Rating: 6.8A; Test Frequency: 100kHz; DC Resistance (DCR): 14.4mR; Height - Seated (Max): 0.177inch; Packaging: Tape and Reel; Resistor Type: Wirewound; Tolerance: 30%; Inductance: 3.3uH; Length: 0.315inch; Number of Pins: 2; Case/Package: SMD/SMT; Mount: Surface Mount; Max DC Current: 6.8A; Width: 0.315inch; Shielding: Shielded; LCSC_PN: C514864
L4 = CMP-06042-011635-1: Shielded Wirewound Inductor 1uH 20% 2900mA 0.048Ω 0806 (2016); LCSC_PN: C521238
LED1 = CMP-1666-00027-1: LED, RED, 2.1 V, -40 to 100 degC, 2-Pin SMD (0603), RoHS, Tape and Reel; Type (Capacitors): C0G; Resistance: 100000000000 Ohm; Capacitance: 12 pF; Voltage Rating: 50 V; Tolerance: 5%; Min Operating Temperature: -55degC; REACH SVHC: No SVHC; ComponentLink2Description: Datasheet; ComponentLink1URL: http://www.vishay.com/; Width: 0.8 mm; Package Quantity: 4000; PackageReference: TLMX1100; ComponentLink2URL: http://www.vishay.com/docs/83173/tlmb1100.pdf; Case/Package: 0603; Case Code (Metric): 1608; Packaging: Tape and Reel; Pins: 2; ComponentLink1Description: Manufacturer URL; Max Operating Temperature: 125degC; Height: 0.8 mm; Length: 1.6 mm; Mount: Surface Mount; PackageDescription: 2-Pin Surface Mount Device, Body 1.6 x 0.8 mm; DatasheetVersion: Rev. 2.7, 03/2016; Case Code (Imperial): 0603; Voltage Rating (DC): 50 V; RoHSCompliant: True; Radiation Hardening: No; LCSC_PN: C510294
LED2 = CMP-1666-00028-1: Blue LED, 10 mA, 3.9 V, -40 to 100 degC, 2-Pin SMD (0603), RoHS, Tape and Reel; Tolerance: 10%; Voltage Rating: 100 V; Capacitance: 10 nF; Type (Capacitors): X7R; Case\Package: Radial; ComponentLink1Description: Manufacturer URL; REACH SVHC: No SVHC; Package Quantity: 500; PackageDescription: 2-Pin Surface Mount Device, Body 1.6 x 0.8 mm; Pins: 2; ComponentLink2URL: http://download.siliconexpert.com/pdfs/2016/8/7/12/43/26/667/vsh_/manual/379263299541529tlmb1100.pdf; RoHSCompliant: true; Lead Pitch: 2.54 mm; Height: 2.54 mm; DatasheetVersion: Rev. 2.7, 03/2016; Length: 5.33 mm; ComponentLink1URL: http://www.vishay.com/; Min Operating Temperature: -55 degC; PackageReference: 0603; Packaging: Bulk; ComponentLink2Description: Datasheet; Max Operating Temperature: 125 degC; Radiation Hardening: No; Width: 3.81 mm; Mount: Through Hole; LCSC_PN: C965853
LED3 = CMP-1426-00006-6: NexarPartId: 29717778; Reverse Voltage: 5V; Forward Voltage: 2V; Viewing Angle: 140°; Luminous Intensity: 40mcd; Test Current: 20mA; Max Junction Temperature (Tj): 95°C; Wavelength: 570nm; Forward Current: 100mA; Color: Green; Lens Style: Clear, Rectangular; Power Dissipation: 72mW; Peak Wavelength: 572nm; Packaging: Tape and Reel; REACH SVHC: Unknown; Width: 800µm; Max Operating Temperature: 85°C; Number of Pins: 2; RoHS: Compliant; Dominant Wavelength: 570nm; Min Operating Temperature: -40°C; Case Code (Imperial): 0603; Height: 700µm; Length: 1.6mm; Case Code (Metric): 1608; Case/Package: 0603; Max Reverse Voltage (DC): 5V; Mount: Surface Mount; LCSC_PN: C2837819
MOD1 = Laird, 453-NX040: Module, Sera NX040, UWB, MHF4L
Q1 = DMP10H400SK3-13: MOSFET (P-Channel); Manufacturer_Name: Diodes Incorporated; Datasheet Link: https://www.diodes.com//assets/Datasheets/DMP10H400SK3.pdf; Height: 2.52mm; Manufacturer_Part_Number: DMP10H400SK3-13; Mouser Part Number: 621-DMP10H400SK3-13; Mouser Price/Stock: https://www.mouser.co.uk/ProductDetail/Diodes-Incorporated/DMP10H400SK3-13?qs=wo71MgyKIyFqONaMc85PEA%3D%3D; Arrow Part Number: DMP10H400SK3-13; Arrow Price/Stock: https://www.arrow.com/en/products/dmp10h400sk3-13/diodes-incorporated?region=nac; LCSC_PN: C177034
Q2 Q3 = CMP-20235-000001-1: NPN TRANSISTOR 1.5A 40V SOT-23 R; Transition Frequency: 100MHz; Max Breakdown Voltage: 25V; Collector Emitter Voltage (VCEO): 400mV; Max Power Dissipation: 300mW; Max Collector Current: 1.5A; Case/Package: TO-236-3; Packaging: Tape and Reel; RoHS Compliant: Yes; Mount: Surface Mount; Collector Emitter Breakdown Voltage: 25V; LCSC_PN: C164886
Q4 = CMP-2000-05968-1: N-Channel Enhancement Mode Mosfet, 50 V, 200 mA, -55 to 150 degC, 6-Pin SOT-323, RoHS, Tape and Reel; Typical Turn-Off Delay Time: 20ns; Number of Channels: 1Channel; Type: EnhancementModeFieldEffectTransistor; Brand: DiodesIncorporated; Vds - Drain-Source Breakdown Voltage: 75V; Vgs - Gate-Source Voltage: 20V; Rds On - Drain-Source Resistance: 1.4Ohms; Transistor Type: 1N-Channel; Configuration: Single; Unit Weight: 0.000212oz; Pd - Power Dissipation: 200mW; Id - Continuous Drain Current: 200mA; Forward Transconductance - Min: 0.1S; Manufacturer URL: http://www.diodes.com/; Series: BSS138; Package Description: 3-Pin Small Outline Transistor, Body 2 x 1.25 mm, Pitch 0.65 mm; Mounting Technology: SurfaceMount; Product Category: MOSFET; RoHS: True; Maximum Operating Temperature: +150C; Height: 1mm; Length: 2.2mm; Technology: Si; Width: 1.35mm; Datasheet URL: http://www.diodes.com/_files/datasheets/ds30206.pdf; Manufacturer: DiodesIncorporated; Package / Case: SOT-323-3; Typical Turn-On Delay Time: 20ns; Transistor Polarity: N-Channel; Factory Pack Quantity: 3000; Packaging: Reel; Product: MOSFETSmallSignal; Datasheet Version: Rev. 11-2, 09/2013; Package Reference: SOT323; Minimum Operating Temperature: -55C; Mounting Style: SMD/SMT; Channel Mode: Enhancement; LCSC_PN: C24553
R1-R3 = CMP-4716590-9: 10K 0603 0.1W 1%; Resistance: 1k; Tolerance: 1%; package: 0603; Octopart Url: https://octopart.com/crcw060310k0fkeahp-vishay-42634028; LCSC_PN: C22548
R4-R8 R10-R15 R18 R19 R22-R35 R37 R38 R40 R41 R43-R50 = CMP-2002-07472-1
  R4 R7 R18: LCSC_PN: C149896
  R5 R31 R33 R35: LCSC_PN: C106235
  R6 R34 R37 R48-R50: LCSC_PN: C106233
  R8 R10 R13 R14 R19 R28 R30 R32 R38 R41 R46: LCSC_PN: C190095
  R11 R12: LCSC_PN: C851231
  R15 R23-R27 R40 R44 R45: LCSC_PN: C60485
  R22: LCSC_PN: C93943
  R29 R47: LCSC_PN: C60491
  R43: LCSC_PN: C138061
R9 R16 R17 = CMP-0abdc173b10ad57a-1: Manufacturer Part Number: WSLP12065L000FEA; Resistance: 0,002; Power: 1W; Octopart URL: https://octopart.com/1-2176055-0-te+connectivity-46440145; Case/Package: 1206; Lifecycle Status: Not Listed by Manufacturer; Packaging: Tape & Reel (TR); OctopartID: 0abdc173b10ad57a; OrderingCode: WSLP12065L000FEA; Manufacturer Part Number 2: FMF06FTHR005-LHL; LCSC_PN: C108081
R36 = CMP-0abdc173b10ad57a-1: 0.002R 1206 0.5W 1%; Manufacturer Part Number: WSLP12065L000FEA; Resistance: 0,005; Power: 1W; Octopart URL: https://octopart.com/1-2176055-0-te+connectivity-46440145; Case/Package: 1206; Lifecycle Status: Not Listed by Manufacturer; Packaging: Tape & Reel (TR); OctopartID: 0abdc173b10ad57a; OrderingCode: WSLP12065L000FEA; Manufacturer Part Number 2: FMF06FTHR005-LHL; LCSC_PN: C723507
RF_PCB1 = CMP-e704afk8c25r4a5ypw1c-12: GSM900 and GSM1800  Frequency Bands PCB antenna; CustomComponentID: e704afk8c25r4a5ypw1c
SW5-SW9 = TS-1101-C-W: Switch; Manufacturer_Name: XKB Connectivity; Datasheet Link: http://www.helloxkb.com/public/images/pdf/TS-1101-X-X.pdf; Height: 2.6mm; Manufacturer_Part_Number: TS-1101-C-W; LCSC_PN: C318938
U1 = TPS5430DDAR: Integrated Circuit; Manufacturer_Name: Texas Instruments; Datasheet Link: http://www.ti.com/lit/gpn/tps5430; Height: 1.7mm; Manufacturer_Part_Number: TPS5430DDAR; Mouser Part Number: 595-TPS5430DDAR; Mouser Price/Stock: https://www.mouser.co.uk/ProductDetail/Texas-Instruments/TPS5430DDAR?qs=zwk82MlA57ZJdOTovH1aYA%3D%3D; Arrow Part Number: TPS5430DDAR; Arrow Price/Stock: https://www.arrow.com/en/products/tps5430ddar/texas-instruments?region=nac; LCSC_PN: C9864
U2 = CMP-0243-00019-3: ARM Cortex-M4 32-bit MCU+FPU, 210 DMIPS, 1024 kB Flash, 192 kB Internal RAM, 51 I/Os, 64-pin LQFP, -40 to 85 degC, Tray; Manufacturer: STMicroelectronics; Supply Voltage(Vcc) min (V): 1.8; Supply Voltage(Vcc) max (V): 3.6; Internal RAM Size (kB): 192; I/Os (High Current): 51; D/A Converter: 2x12-bit; FLASH Size (Prog) (kB): 1024; Operating Frequency(F) (Processor speed) (MHz): 168; ComponentLink2Description: Datasheet; PackageVersion: Rev. 4, 06/2013; DatasheetVersion: Rev. 4; Core: ARM Cortex-M4; ComponentLink2URL: http://www.st.com/st-web-ui/static/active/en/resource/technical/document/datasheet/DM00037051.pdf; PackageReference: LQFP64; Packing: Tray; ComponentLink1Description: Manufacturer URL; ComponentLink3URL: http://www.st.com/st-web-ui/static/active/en/resource/technical/document/datasheet/DM00037051.pdf; ComponentLink3Description: Package Specification; Mounting Technology: Surface Mount; ComponentLink1URL: http://www.st.com/web/en/home.html; PackageDescription: 64-Pin Low Profile Quad Flat Package, 10 x 10 mm Body, 0.5 mm Pitch; PartNumber: STM32F405RGT6; LCSC_PN: C15742
U6 = CMP-04918-000435-1: POWER MANAGEMENT; LCSC_PN: C779412
U7 U8 = BMI088: High-performance 6-axis inertial sensor (accelerometer + gyroscope) <a href="https://pricing.snapeda.com/parts/BMI088/Bosch%20Sensortec/view-part?ref=eda">Check prices</a>; Package: None; MP: BMI088; Value: *; Availability: Unavailable; Price: None; LCSC_PN: C194919
U9 = CMP-08093-000007-1: IC USB TO UART BRIDGE QFN28; LCSC_PN: C964632
U11 = CMP-72dbb8ea0133ad1c-5: Module: GSM/Bluetooth; GPRS; 2G; 1800MHz, 900MHz; 85.6kbps; SMD; OctopartID: 72dbb8ea0133ad1c; Manufacturer Part Number: SIM800C; Mounting Style: Surface Mount; Octopart URL: http://octopart.com/sim800c-simcom-54220430; LCSC Part: C69120; LCSC_PN: C69119
U12 = BQ25672RQMR: Integrated Circuit; Manufacturer_Name: Texas Instruments; Datasheet Link: https://www.ti.com/lit/ds/symlink/bq25672.pdf; Height: 1mm; Manufacturer_Part_Number: BQ25672RQMR; Mouser Part Number: 595-BQ25672RQMR; Mouser Price/Stock: https://www.mouser.co.uk/ProductDetail/Texas-Instruments/BQ25672RQMR?qs=ljCeji4nMDntn8Xa8JfKdA%3D%3D; Arrow Part Number: BQ25672RQMR; Arrow Price/Stock: https://www.arrow.com/en/products/bq25672rqmr/texas-instruments?region=nac; LCSC_PN: C3682029
U13 = CMP-ce8f06c57f401148-2: Embedded SIM card in MFF2; DNP: DNP; LCSC_PN: C5122390
Y1 = TAXM8M4RDBCCT2T: Crystal or Oscillator; Manufacturer_Name: TAE(Zhejiang Abel Elec); Datasheet Link: https://datasheet.lcsc.com/lcsc/1912111437_TAE-Zhejiang-Abel-Elec-TAXM8M4RDBCCT2T_C400090.pdf; Height: 0.8mm; Manufacturer_Part_Number: TAXM8M4RDBCCT2T; LCSC_PN: C400090